# EAGLE schematic SENTRY Board Schematic (EAGLE 9.7.0)
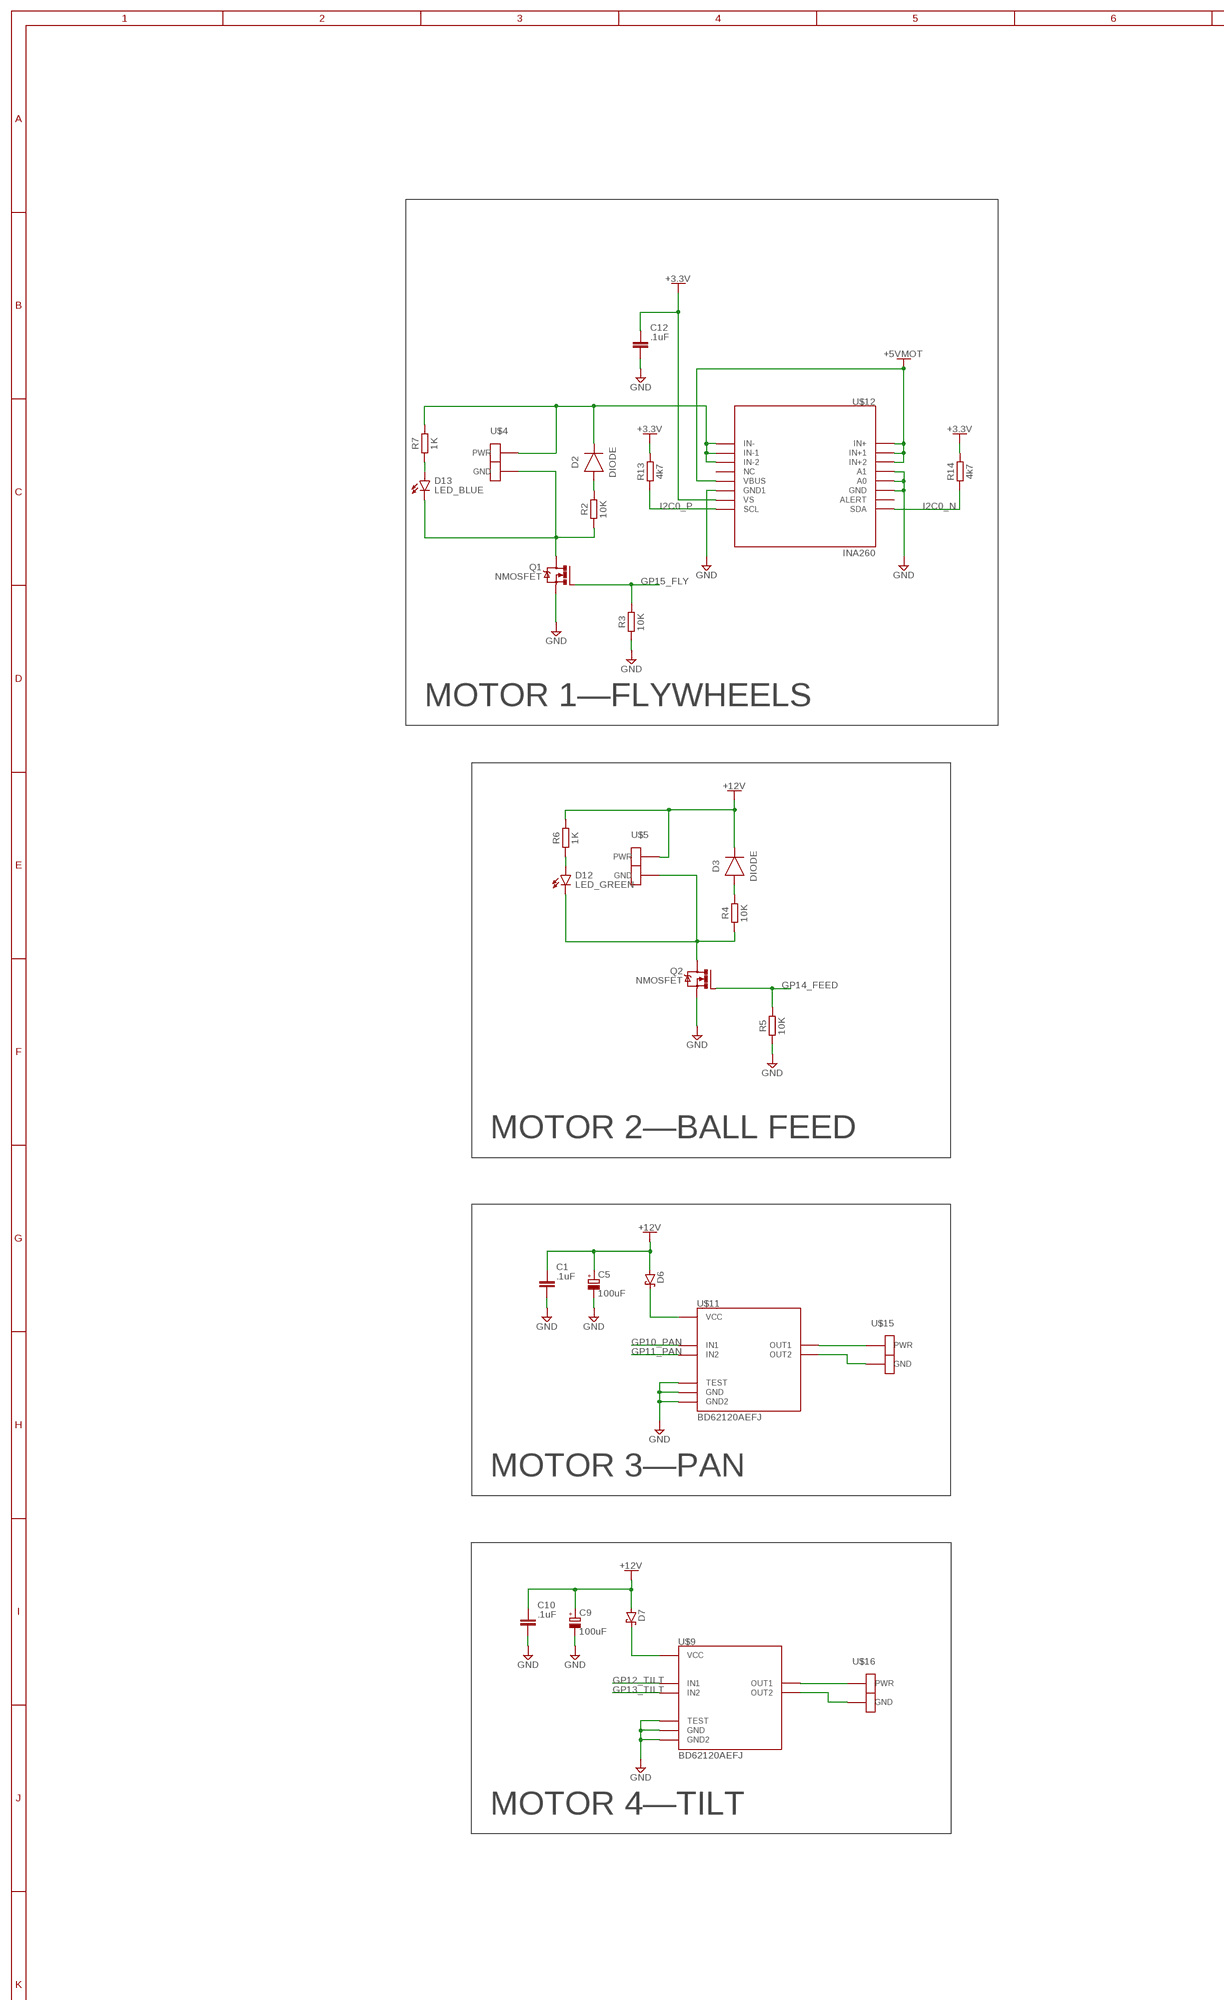
[diagram p0: schematic, sheet 1, part 1 of 3]
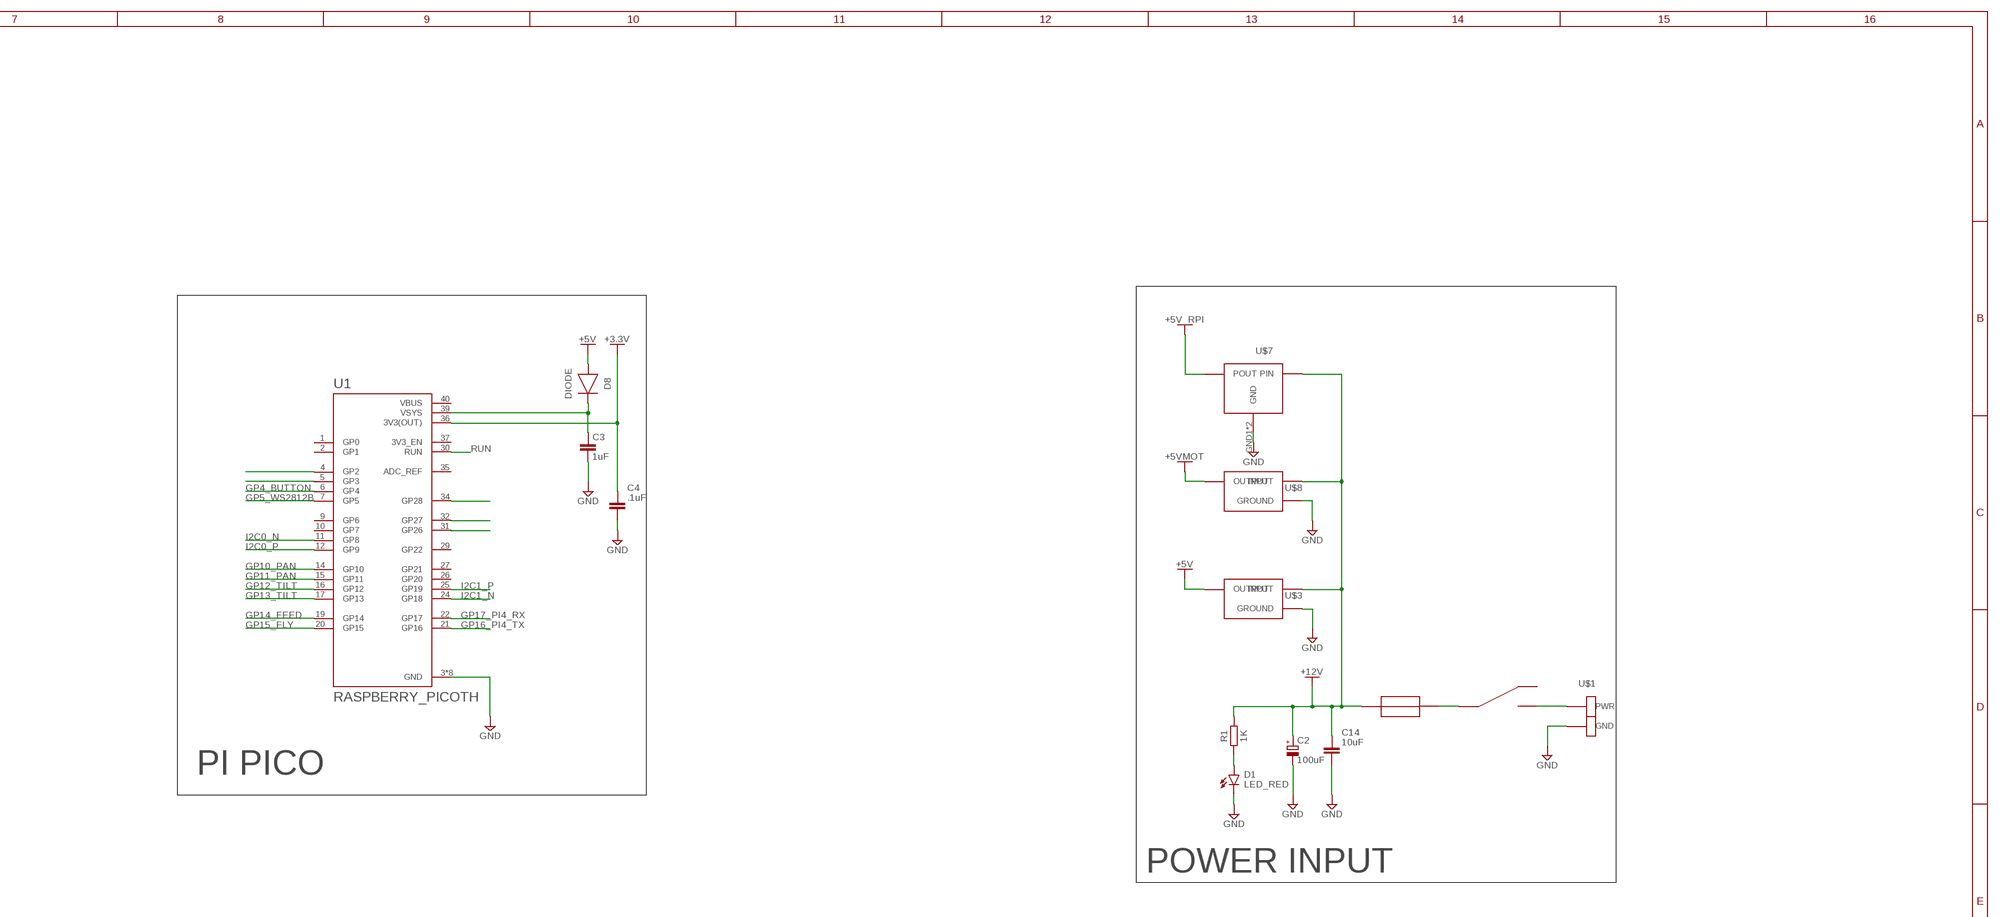
[diagram p1: schematic, sheet 1, part 2 of 3]
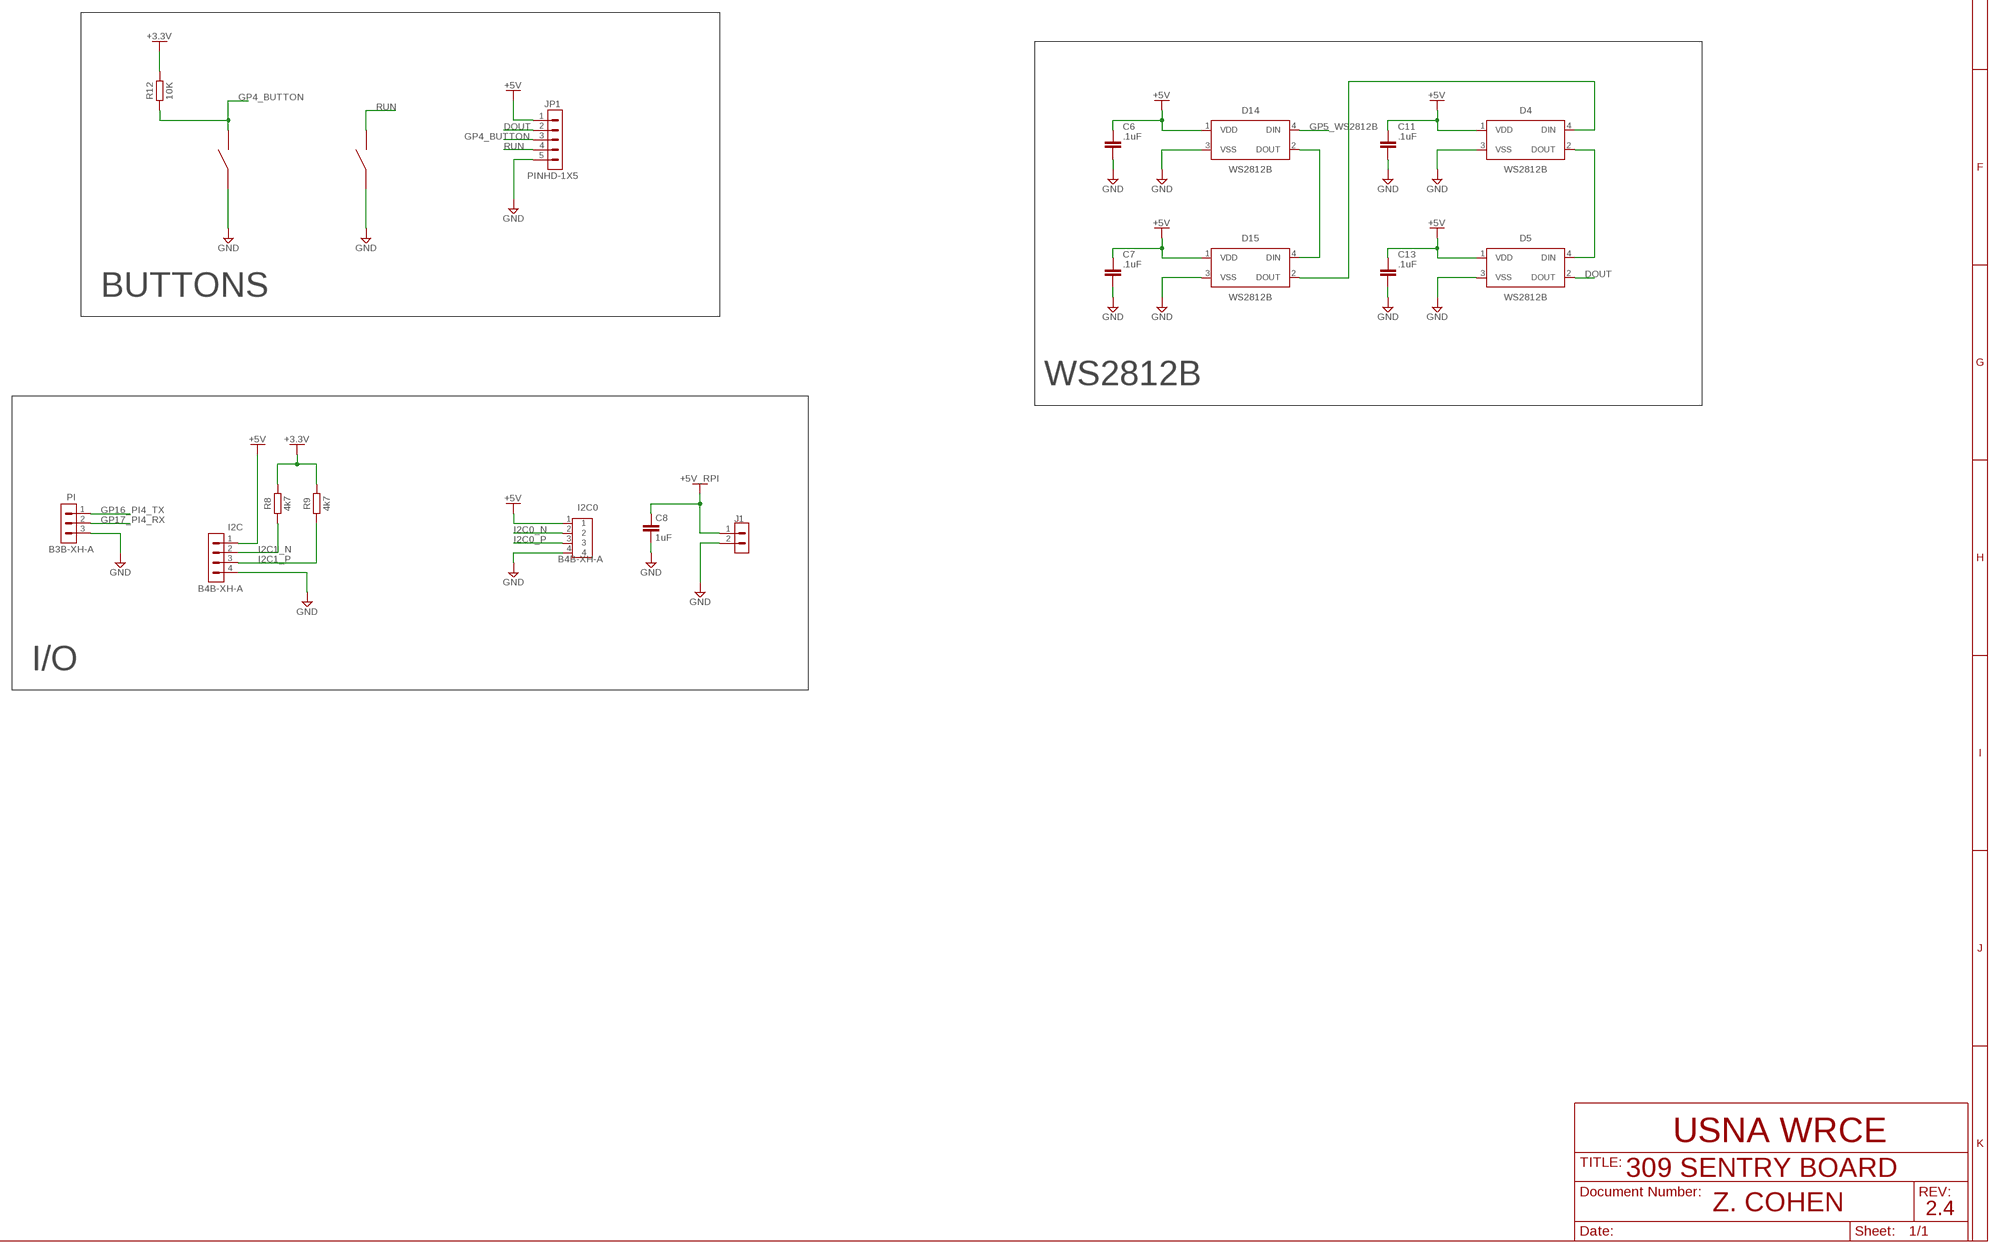
[diagram p2: schematic, sheet 1, part 3 of 3]

## Parts
C1  .1uF  C_CHIP-0805(2012-METRIC)  [CAPC2012X110]
C2  100uF  C-POL_ECAP-8.5MM  [CAPAE830X1050N]
C3  1uF  C_CHIP-0805(2012-METRIC)  [CAPC2012X110]
C4  .1uF  C_CHIP-0805(2012-METRIC)  [CAPC2012X110]
C5  100uF  C-POL_ECAP-8.5MM  [CAPAE830X1050N]
C6  .1uF  C_CHIP-0805(2012-METRIC)  [CAPC2012X110]
C7  .1uF  C_CHIP-0805(2012-METRIC)  [CAPC2012X110]
C8  1uF  C_CHIP-0805(2012-METRIC)  [CAPC2012X110]
C9  100uF  C-POL_ECAP-8.5MM  [CAPAE830X1050N]
C10  .1uF  C_CHIP-0805(2012-METRIC)  [CAPC2012X110]
C11  .1uF  C_CHIP-0805(2012-METRIC)  [CAPC2012X110]
C12  .1uF  C_CHIP-0805(2012-METRIC)  [CAPC2012X110]
C13  .1uF  C_CHIP-0805(2012-METRIC)  [CAPC2012X110]
C14  10uF  C_CHIP-0805(2012-METRIC)  [CAPC2012X110]
D1  LED_RED  CHIP-FLAT-R_0805  [LEDC2012X110N_FLAT-R]
D2  DIODE  DIODEDO-214AC(SMA)  [DIOM5226X290N]
D3  DIODE  DIODEDO-214AC(SMA)  [DIOM5226X290N]
D4  WS2812B  [WS2812B]
D5  WS2812B  [WS2812B]
D6  SCHOTTKY-DIODESMC  [SMC]
D7  SCHOTTKY-DIODESMC  [SMC]
D8  DIODE  DIODEDO-214AC(SMA)  [DIOM5226X290N]
D12  LED_GREEN  CHIP-FLAT-G_0805  [LEDC2012X110N_FLAT-G]
D13  LED_BLUE  CHIP-FLAT-B_0805  [LEDC2012X110N_FLAT-B]
D14  WS2812B  [WS2812B]
D15  WS2812B  [WS2812B]
I2C  B4B-XH-A  [B4B-XH-A]
I2C0  B4B-XH-A  [B4B-XH-A]
J1  JST-XH-2PIN  B2B-XH-A  [B2B-XH-A]
JP1  PINHD-1X5  [1X05]
PI  B3B-XH-A  [B3B-XH-A]
Q1  NMOSFET  NMOSFET_TO220  [TO220BV]
Q2  NMOSFET  NMOSFET_TO220  [TO220BV]
R1  1K  R_CHIP-0805(2012-METRIC)  [RESC2012X65]
R2  10K  R_CHIP-0805(2012-METRIC)  [RESC2012X65]
R3  10K  R_CHIP-0805(2012-METRIC)  [RESC2012X65]
R4  10K  R_CHIP-0805(2012-METRIC)  [RESC2012X65]
R5  10K  R_CHIP-0805(2012-METRIC)  [RESC2012X65]
R6  1K  R_CHIP-0805(2012-METRIC)  [RESC2012X65]
R7  1K  R_CHIP-0805(2012-METRIC)  [RESC2012X65]
R8  4k7  R_CHIP-0603(1608-METRIC)  [RESC1608X60]
R9  4k7  R_CHIP-0603(1608-METRIC)  [RESC1608X60]
R12  10K  R_CHIP-0805(2012-METRIC)  [RESC2012X65]
R13  4k7  R_CHIP-0603(1608-METRIC)  [RESC1608X60]
R14  4k7  R_CHIP-0603(1608-METRIC)  [RESC1608X60]
U1  RASPBERRY_PICOTH  [PICO-PKG-TH]
U$1  ANDERSONBOARDCONNECTORHORIZONTAL  [ANDERSONBOARDCONNECTOR]
U$2  5A  154_OMNI_BLOK_FUSE_HOLDER  [154_OMNI_BLOK_FUSE_HOLDER]
U$3  OKI-78SRVERTICAL  [OKI-78SRVERT]
U$4  ANDERSONBOARDCONNECTORHORIZONTAL  [ANDERSONBOARDCONNECTOR]
U$5  ANDERSONBOARDCONNECTORHORIZONTAL  [ANDERSONBOARDCONNECTOR]
U$7  DX36V28FX  [DX36V28FX]
U$8  OKI-78SRVERTICAL  [OKI-78SRVERT]
U$9  BD62120AEFJ  [BD62120AEFJ]
U$10  SN50SMTR2SWITCH  [SN50SMTR2SWITCH]
U$11  BD62120AEFJ  [BD62120AEFJ]
U$12  INA260  [INA260]
U$13  TACTILE_SWITCH  [TACTILE_SWITCH]
U$14  500SSP3S1M6QEA_SWITCH  [500SSP3S1M6QEA_SWITCH]
U$15  ANDERSONBOARDCONNECTORHORIZONTAL  [ANDERSONBOARDCONNECTOR]
U$16  ANDERSONBOARDCONNECTORHORIZONTAL  [ANDERSONBOARDCONNECTOR]

## Nets
+3.3V [PWRLOW]: C4.1 C12.1 R8.2 R9.2 R12.2 R13.2 R14.2 U1.36(3V3(OUT)) U$12.P$10(VS)
+5V [PWRLOW]: C6.1 C7.1 C11.1 C13.1 D4.1(VDD) D5.1(VDD) D8.2(A) D14.1(VDD) D15.1(VDD) I2C0.1 I2C.1 JP1.1 U$3.OUT(OUTPUT)
+5V_RPI: C8.1 J1.1 U$7.OUT
+5VMOT [PWR]: U$8.OUT(OUTPUT) U$12.P$1(IN+) U$12.P$2(IN+1) U$12.P$3(IN+2) U$12.P$12(VBUS)
+12V [PWR]: C1.1 C2.1(+) C5.1(+) C9.1(+) C10.1 C14.1 D3.1(C) D6.A D7.A R1.2 R6.2 U$2.P$1 U$3.IN(INPUT) U$5.PWR U$7.IN U$8.IN(INPUT)
DOUT: D5.2(DOUT) JP1.2
GND [GND]: C1.2 C2.2(-) C3.2 C4.2 C5.2(-) C6.2 C7.2 C8.2 C9.2(-) C10.2 C11.2 C12.2 C13.2 C14.2 D1.C D4.3(VSS) D5.3(VSS) D14.3(VSS) D15.3(VSS) I2C0.4 I2C.4 J1.2 JP1.5 PI.3 Q1.S Q2.S R3.1 R5.1 U1.3(GND) U1.8(GND) U1.13(GND) U1.18(GND) U1.23(GND) U1.28(GND) U1.33(GND) U1.38(GND) U$1.GND U$3.GND(GROUND) U$7.GND1(GND) U$7.GND2(GND) U$8.GND(GROUND) U$9.P$1(GND) U$9.P$4(GND2) U$9.P$7(TEST) U$9.P$9(GND) U$10.P$1 U$10.P$3 U$11.P$1(GND) U$11.P$4(GND2) U$11.P$7(TEST) U$11.P$9(GND) U$12.P$4(A1) U$12.P$5(A0) U$12.P$6(GND) U$12.P$11(GND1) U$13.P$1 U$13.P$3
GP4_BUTTON: JP1.3 R12.1 U1.6(GP4) U$10.P$2 U$10.P$4
GP5_WS2812B: D14.4(DIN) U1.7(GP5)
GP10_PAN: U1.14(GP10) U$11.P$5(IN1)
GP11_PAN: U1.15(GP11) U$11.P$6(IN2)
GP12_TILT: U1.16(GP12) U$9.P$5(IN1)
GP13_TILT: U1.17(GP13) U$9.P$6(IN2)
GP14_FEED: Q2.G R5.2 U1.19(GP14)
GP15_FLY: Q1.G R3.2 U1.20(GP15)
GP16_PI4_TX: PI.1 U1.21(GP16)
GP17_PI4_RX: PI.2 U1.22(GP17)
I2C0_N: I2C0.2 R14.1 U1.11(GP8) U$12.P$8(SDA)
I2C0_P: I2C0.3 R13.1 U1.12(GP9) U$12.P$9(SCL)
I2C1_N: I2C.2 R8.1 U1.24(GP18)
I2C1_P: I2C.3 R9.1 U1.25(GP19)
N$1 [SIGNAL]: U$1.PWR U$14.P$3
N$2 [SIGNAL]: D1.A R1.1
N$3 [PWR]: D13.C Q1.D R2.1 U$4.GND
N$4 [SIGNAL]: D2.2(A) R2.2
N$5: D14.2(DOUT) D15.4(DIN)
N$6: U1.32(GP27)
N$7 [SIGNAL]: D3.2(A) R4.2
N$8 [PWRLOW]: C3.1 D8.1(C) U1.39(VSYS)
N$9 [PWR]: D2.1(C) R7.2 U$4.PWR U$12.P$14(IN-2) U$12.P$15(IN-1) U$12.P$16(IN-)
N$10: U1.31(GP26)
N$11 [PWR]: D12.C Q2.D R4.1 U$5.GND
N$12: U$11.P$2(OUT1) U$15.PWR
N$13: U$11.P$8(OUT2) U$15.GND
N$14: D4.2(DOUT) D5.4(DIN)
N$15: D4.4(DIN) D15.2(DOUT)
N$16: U$9.P$2(OUT1) U$16.PWR
N$17: U$9.P$8(OUT2) U$16.GND
N$18: D13.A R7.1
N$19: D12.A R6.1
N$20 [PWR]: D6.C U$11.P$3(VCC)
N$21 [PWR]: D7.C U$9.P$3(VCC)
N$23 [SIGNAL]: U$2.P$2 U$14.P$2
N$24: U1.4(GP2)
N$25: U1.5(GP3)
N$46: U1.34(GP28)
RUN: JP1.4 U1.30(RUN) U$13.P$2 U$13.P$4
Unconnected: U1.1(GP0) U1.2(GP1) U1.9(GP6) U1.10(GP7) U1.26(GP20) U1.27(GP21) U1.29(GP22) U1.35(ADC_REF) U1.37(3V3_EN) U1.40(VBUS) U$12.P$7(ALERT) U$12.P$13(NC)

## Notes on the sheet
- MOTOR 1—FLYWHEELS
- PI PICO
- POWER INPUT
- MOTOR 2—BALL FEED
- BUTTONS
- WS2812B
- MOTOR 3—PAN
- I/O
- MOTOR 4—TILT
- USNA WRCE
- 309 SENTRY BOARD
- Z. COHEN | 2.4

## Power pins joined to a net without a drawn wire
11: U$14.P$1

## Library data of the parts
C1 C4 C6 C7 C10-C14 = Capacitor:C: Capacitor - Generic; CATEGORY: Capacitor; PACKAGE_SIZE: 0805; PACKAGE_TYPE: SMD; SUBCATEGORY: Ceramic Capacitors; TYPE: MLCC
C2 C5 C9 = Capacitor:C-POL: Capacitor Polarised - Generic; CATEGORY: Capacitor; PACKAGE_SIZE: 8.5MM; PACKAGE_TYPE: SMD; SUBCATEGORY: Aluminum Electrolytic Capacitors; TYPE: Radial Can
C3 C8 = Capacitor:C: Capacitor - Generic; CATEGORY: Capacitor
D1 = LED:CHIP-FLAT-R; CATEGORY: LED; COLOR: RED; DESCRIPTION: CHIP LED FLAT; SUB-CATEGORY: CHIP; TYPE: FLAT_TOP
D2 D3 D8 = Diode:DIODE: Diode Rectifier - Generic; CATEGORY: Diode; SUB-CATEGORY: Rectifier
D4 D5 D14 D15 = LED:WS2812B: Intelligent control LED integrated light source Datasheet <http://cdn.sparkfun.com/datasheets/BreakoutBoards/WS2812B.pdf>; CATEGORY: LED; COLOR: RGB; DESCRIPTION: LED integrated light source; MANUFACTURER: Worldsemi; MPN: WS2812B; OPERATING_TEMP: -25 ℃ to +80℃(TJ); PART_STATUS: Active; SUB_CATEGORY: RGB
D6 D7 = diode:SCHOTTKY-DIODE: Schottky Diode
D12 = LED:CHIP-FLAT-G; CATEGORY: LED; COLOR: GREEN; DESCRIPTION: CHIP LED FLAT; SUB-CATEGORY: CHIP; TYPE: FLAT_TOP
D13 = LED:CHIP-FLAT-B; CATEGORY: LED; COLOR: BLUE; DESCRIPTION: CHIP LED FLAT; SUB-CATEGORY: CHIP; TYPE: FLAT_TOP
I2C = Connector:B4B-XH-A: XH Connector Top Entry - 4POS Reference: Datasheet <http://www.jst-mfg.com/product/pdf/eng/eXH.pdf>; CATEGORY: Connectors; DATASHEET: https://www.jst-mfg.com/product/pdf/eng/eXH.pdf; DESCRIPTION: Connector Header Through Hole 4 position 0.098" (2.50mm); MANUFACTURER: JST Sales America Inc.; MPN: B4B-XH-A; OPERATING_TEMPERATURE: -25°C ~ 85°C; PACKAGE_SIZE: NA; PACKAGE_TYPE: Through Hole; PART_STATUS: Active; PITCH: 0.098" (2.50mm); ROHS: Compliant; SERIES: XH; SUBCATEGORY: Rectangular Connectors; TYPE: Male Headers
I2C0 = Connector:B4B-XH-A: XH Connector Top Entry - 4POS Details see: Datasheet <http://www.jst-mfg.com/product/pdf/eng/eXH.pdf>; CATEGORY: Header; DSECRIPTION: Connector Header Through Hole 4 position 0.098" (2.50mm); MANUFACTURER: JST Sales America Inc.; MPN: B4B-XH-A(LF)(SN); OPERATING_TEMPERATURE: -25 C to 85 C; PART_STATUS: ACTIVE; PITCH: 0.098" (2.50mm); ROHS_COMPLIANCE: ROHS3 Compliant; SERIES: XH; SUB_CATEGORY: Rectangular Connectors; TYPE: Header, Male Pin, Board to Cable/Wire, Through Hole
J1 = Connector:B2B-XH-A: XH Connector Top Entry - 2POS Reference: : Datasheet <http://www.jst-mfg.com/product/pdf/eng/eXH.pdf>; CATEGORY: Connectors; DATASHEET: https://www.jst-mfg.com/product/pdf/eng/eXH.pdf; DESCRIPTION: Connector Header Through Hole 2 position 0.098" (2.50mm); MANUFACTURER: JST Sales America Inc.; MPN: B2B-XH-A; OPERATING_TEMPERATURE: -25°C ~ 85°C; PACKAGE_SIZE: NA; PACKAGE_TYPE: Through Hole; PART_STATUS: Active; PITCH: 0.098" (2.50mm); ROHS: Compliant; SERIES: XH; SUBCATEGORY: Rectangular Connectors; TYPE: Male Headers
JP1 = Connector:PINHD-1X5: Pin Header; CATEGORY: Connectors; DESCRIPTION: Header-Straight-5 Position; PACKAGE_TYPE: Through Hole; PITCH: 0.100" (2.54mm); SUBCATEGORY: Headers; TYPE: Male Pins
PI = Connector:B3B-XH-A: XH Connector Top Entry - 3POS Reference: Datasheet <http://www.jst-mfg.com/product/pdf/eng/eXH.pdf>; CATEGORY: Connectors; DATASHEET: https://www.jst-mfg.com/product/pdf/eng/eXH.pdf; DESCRIPTION: Connector Header Through Hole 3 position 0.098" (2.50mm); MANUFACTURER: JST Sales America Inc.; MPN: B3B-XH-A; OPERATING_TEMPERATURE: -25°C ~ 85°C; PACKAGE_SIZE: NA; PACKAGE_TYPE: Through Hole; PART_STATUS: Active; PITCH: 0.098" (2.50mm); ROHS: Compliant; SERIES: XH; SUBCATEGORY: Rectangular Connectors; TYPE: Male Headers
Q1 Q2 = Transistor:NMOSFET: N-Channel MOSFET - Generic; CATEGORY: Transistor; SUB-CATEGORY: MOSFET; TYPE: N-Channel
R1-R7 R12 = Resistor:R: Resistor Fixed - Generic; CATEGORY: Resistors; DESCRIPTION: Chip Resistor 2.00 X 1.25 X 0.65 mm body 0805(2012-METRIC) Package; PACKAGE_SIZE: 0805; PACKAGE_TYPE: SMD
R8 R9 R13 R14 = Resistor:R: Resistor Fixed - Generic; CATEGORY: Resistors; DESCRIPTION: Chip Resistor 1.60 X 0.82 X 0.60 mm body 0603(1608-METRIC) Package; PACKAGE_SIZE: 0603; PACKAGE_TYPE: SMD
U1 = CohenLibrary:RASPBERRY_PICO: Raspberry Pi Pico
U$1 U$4 U$5 U$15 U$16 = CohenLibrary:ANDERSONBOARDCONNECTOR: https://www.digikey.com/en/products/detail/anderson-power-products-inc/1336G1/10650490
U$2 = CohenLibrary:154_OMNI_BLOK_FUSE_HOLDER: https://www.digikey.com/en/products/detail/littelfuse-inc/0154001-DR/183352
U$3 U$8 = CohenLibrary:OKI-78SR: https://www.digikey.com/en/products/detail/murata-power-solutions-inc/OKI-78SR-5-1-5-W36-C/2259781
U$7 = CohenLibrary:DX36V28FX
U$9 U$11 = CohenLibrary:BD62120AEFJ: https://www.digikey.com/en/products/detail/rohm-semiconductor/BD62120AEFJ-E2/10233249?s=N4IgTCBcDaIEIBEBsYCMYAMBBAogMQCkQBdAXyA
U$10 = CohenLibrary:SN50SMTR2SWITCH: https://www.digikey.com/en/products/detail/c-k/PTS647SN50SMTR2-LFS/9649857?s=N4IgTCBcDaIMoDkCsAGOBZAKgJQgXQF8g
U$12 = CohenLibrary:INA260: https://www.digikey.com/en/products/detail/texas-instruments/INA260AIPWR/6590780
U$13 = CohenLibrary:TACTILE_SWITCH: https://www.digikey.com/en/products/detail/c-k/PTS815SJM250SMTRLFS/9947846
U$14 = CohenLibrary:500SSP3S1M6QEA_SWITCH